# EAGLE design 644-alt-layout-routed (EAGLE 7.2.0)
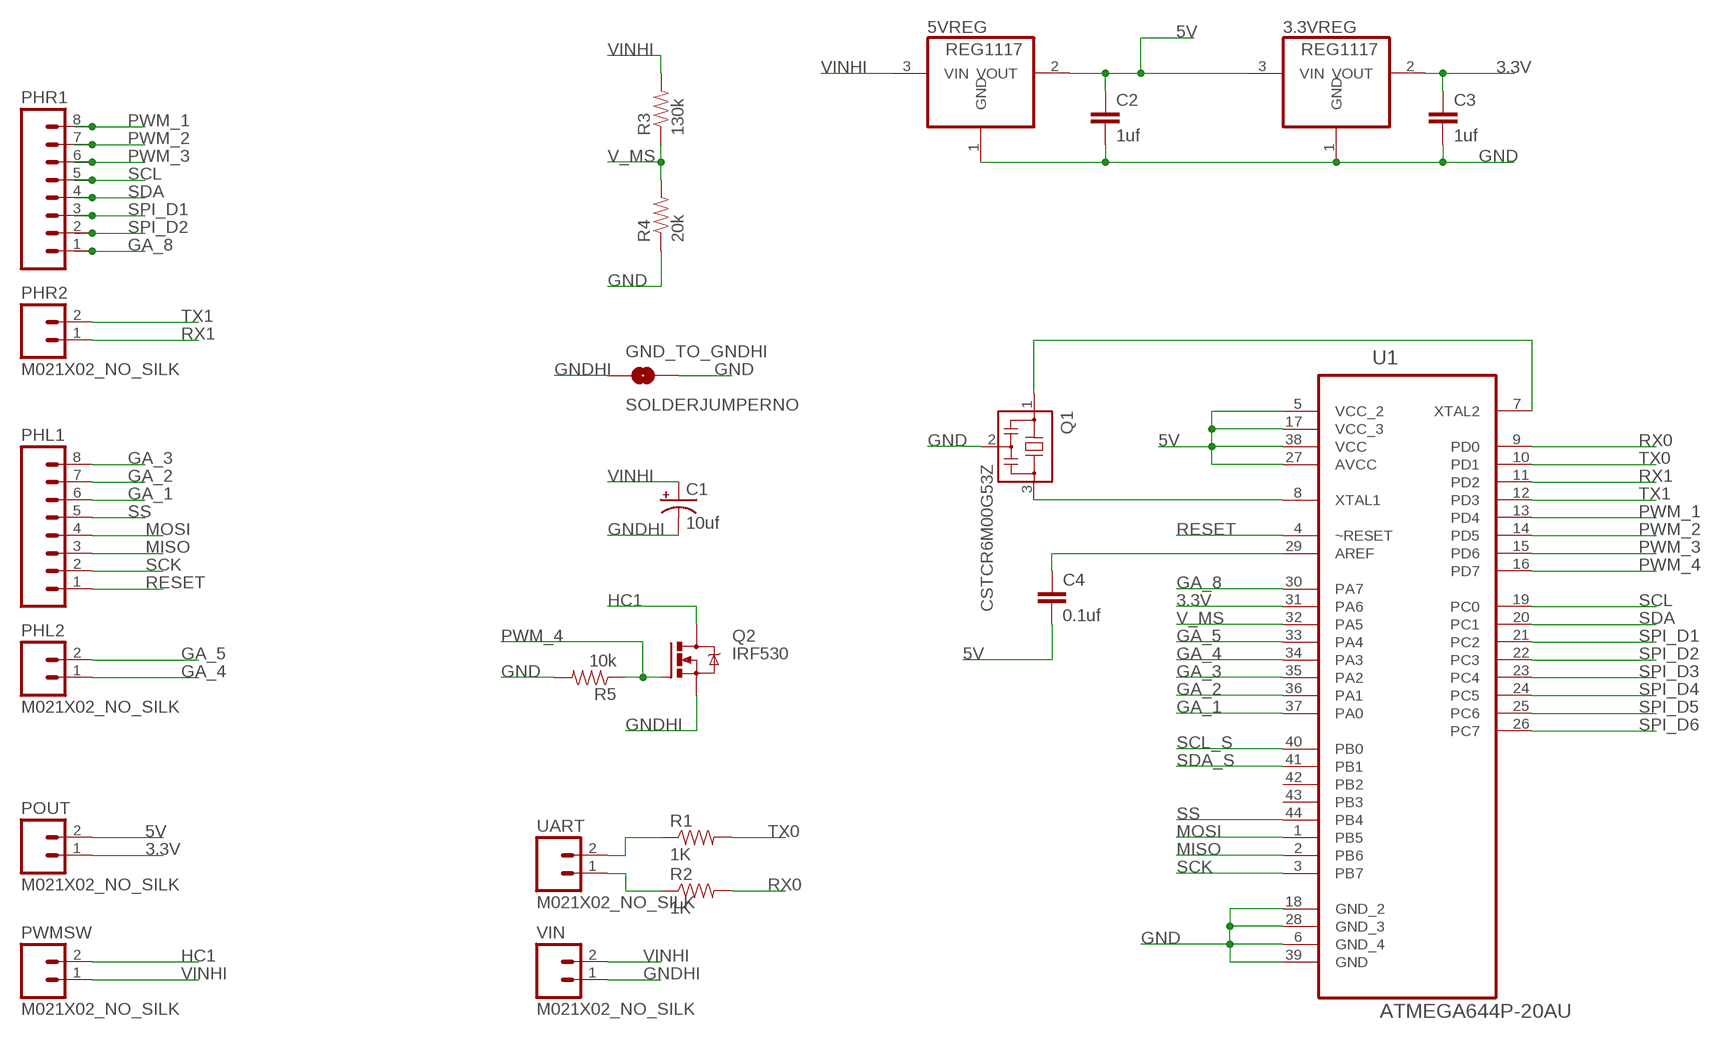
[diagram p0: schematic, sheet 1]

## Parts
3.3VREG  REG1117  [SOT223]
5VREG  REG1117  [SOT223]
C1  10uf  CAP_POL1206  [EIA3216]
C2  1uf  CAP0603-CAP  [0603-CAP]
C3  1uf  CAP0603-CAP  [0603-CAP]
C4  0.1uf  CAP0603-CAP  [0603-CAP]
GND_TO_GNDHI  SOLDERJUMPERNO  [SJ_2S-NO]
PHL1  M08NO_SILK  [1X08_PIN1_NO_SILK]
PHL2  M021X02_NO_SILK  [1X02_NO_SILK]
PHR1  M08NO_SILK  [1X08_PIN1_NO_SILK]
PHR2  M021X02_NO_SILK  [1X02_NO_SILK]
POUT  M021X02_NO_SILK  [1X02_NO_SILK]
PWMSW  M021X02_NO_SILK  [1X02_NO_SILK]
Q1  CSTCR6M00G53Z  [CSTCR6M]
Q2  IRF530  [TO220BV]
R1  1K  RESISTOR0603-RES  [0603-RES]
R2  1K  RESISTOR0603-RES  [0603-RES]
R3  130k  RESISTOR0603-RES  [0603-RES]
R4  20k  RESISTOR0603-RES  [0603-RES]
R5  10k  RESISTOR0603-RES  [0603-RES]
U1  ATMEGA644P-20AU  [QFP80P1200X1200X120-44N]
UART  M021X02_NO_SILK  [1X02_NO_SILK]
VIN  M021X02_NO_SILK  [1X02_NO_SILK]

## Nets
3.3V: 3.3VREG.2(VOUT) C3.1 POUT.1 U1.31(PA6)
5V: 3.3VREG.3(VIN) 5VREG.2(VOUT) C2.1 C4.2 POUT.2 U1.5(VCC_2) U1.17(VCC_3) U1.27(AVCC) U1.38(VCC)
GA_1: PHL1.6 U1.37(PA0)
GA_2: PHL1.7 U1.36(PA1)
GA_3: PHL1.8 U1.35(PA2)
GA_4: PHL2.1 U1.34(PA3)
GA_5: PHL2.2 U1.33(PA4)
GA_8: PHR1.1 U1.30(PA7)
GND: 3.3VREG.1(GND) 5VREG.1(GND) C2.2 C3.2 GND_TO_GNDHI.2 Q1.2 R4.1 R5.2 U1.6(GND_4) U1.18(GND_2) U1.28(GND_3) U1.39(GND)
GNDHI [hi]: C1.C(-) GND_TO_GNDHI.1 Q2.S VIN.1
HC1 [hi]: PWMSW.2 Q2.D
MISO: PHL1.3 U1.2(PB6)
MOSI: PHL1.4 U1.1(PB5)
N$1: Q1.3 U1.8(XTAL1)
N$2: Q1.1 U1.7(XTAL2)
N$3: C4.1 U1.29(AREF)
N$4: R1.1 UART.2
N$5: R2.1 UART.1
PWM_1: PHR1.8 U1.13(PD4)
PWM_2: PHR1.7 U1.14(PD5)
PWM_3: PHR1.6 U1.15(PD6)
PWM_4: Q2.G R5.1 U1.16(PD7)
RESET: PHL1.1 U1.4(~RESET)
RX0: R2.2 U1.9(PD0)
RX1: PHR2.1 U1.11(PD2)
SCK: PHL1.2 U1.3(PB7)
SCL: PHR1.5 U1.19(PC0)
SCL_S: U1.40(PB0)
SDA: PHR1.4 U1.20(PC1)
SDA_S: U1.41(PB1)
SPI_D1: PHR1.3 U1.21(PC2)
SPI_D2: PHR1.2 U1.22(PC3)
SPI_D3: U1.23(PC4)
SPI_D4: U1.24(PC5)
SPI_D5: U1.25(PC6)
SPI_D6: U1.26(PC7)
SS: PHL1.5 U1.44(PB4)
TX0: R1.2 U1.10(PD1)
TX1: PHR2.2 U1.12(PD3)
V_MS: R3.1 R4.2 U1.32(PA5)
VINHI [hi]: 5VREG.3(VIN) C1.A(+) PWMSW.1 R3.2 VIN.2
Unconnected: U1.42(PB2) U1.43(PB3)

## Library data of the parts
3.3VREG 5VREG = burr-brown:REG1117: 800mA and 1A Low Dropout (LDO) Positive Regulator 1.8V, 2.5V, 2.85V, 3.3V, 5V, and Adj; MPN: REG1117; OC_FARNELL: 1097566; OC_NEWARK: 14P6981
C1 = SparkFun-Capacitors:CAP_POL: Capacitor Polarized These are standard SMD and PTH capacitors. Normally 10uF, 47uF, and 100uF in electrolytic and tantalum varieties. Always verify the external diameter of the through hole cap, it varies with capacity, voltage, and manufacturer. The EIA devices should be standard.
C2-C4 = SparkFun-Capacitors:CAP: Capacitor Standard 0603 ceramic capacitor, and 0.1" leaded capacitor.
GND_TO_GNDHI = SparkFun-Retired:SOLDERJUMPER: Solder Jumper Standard SMD solder jumper. Used to automate production. Two varients : Normally Open and Normally Closed are the same, but have different paste layers. NC will have a large amount of paste and should jumper during reflow.
PHL1 PHR1 = SparkFun-Connectors:M08: Header 8 Standard 8-pin 0.1" header. Use with straight break away headers (SKU : PRT-00116), right angle break away headers (PRT-00553), swiss pins (PRT-00743), machine pins (PRT-00117), and female headers (PRT-00115).
PHL2 PHR2 POUT PWMSW UART VIN = SparkFun-Connectors:M02: Standard 2-pin 0.1" header. Use with - straight break away headers ( PRT-00116) - right angle break away headers (PRT-00553) - swiss pins (PRT-00743) - machine pins (PRT-00117) - female headers (PRT-00115) Molex polarized connector foot print use with: PRT-08233 with associated crimp pins and housings. 2.54_SCREWTERM for use with PRT-10571. 3.5mm Screw Terminal footprints for PRT-08084 5mm Screw Terminal footprints for use with PRT-08432
Q1 = murata-filter:CSTCR: Resonator Source: murata.co.jp; MPN: CSTCR6M00G53-R0; OC_FARNELL: 1170434; OC_NEWARK: 25M8759
Q2 = transistor-power:IRF530: HEXFET Power MOSFET
R1-R5 = SparkFun-Passives:RESISTOR: Resistor Basic schematic elements and footprints for 0603, 1206, and PTH resistors.
U1 = Atmel_By_element14_Batch_1-00:ATMEGA644P-20AU: 8-bit Microcontroller with Bytes In-System Programmable Flash; MPN: ATMEGA644P-20AU; OC_FARNELL: 1455121; OC_NEWARK: 58M3746; PACKAGE: TQFP-44; SUPPLIER: Atmel

## Net classes
0 default: width 0.203 mm, clearance 0.152 mm
1 hi: width 0.813 mm, clearance 0.152 mm

## Board
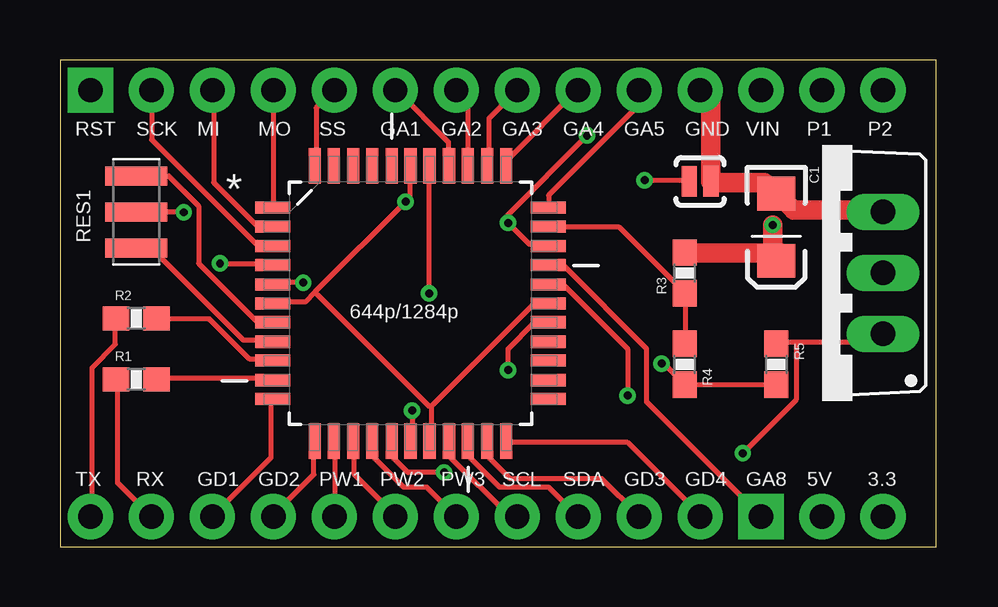
[diagram p1: board, top side]
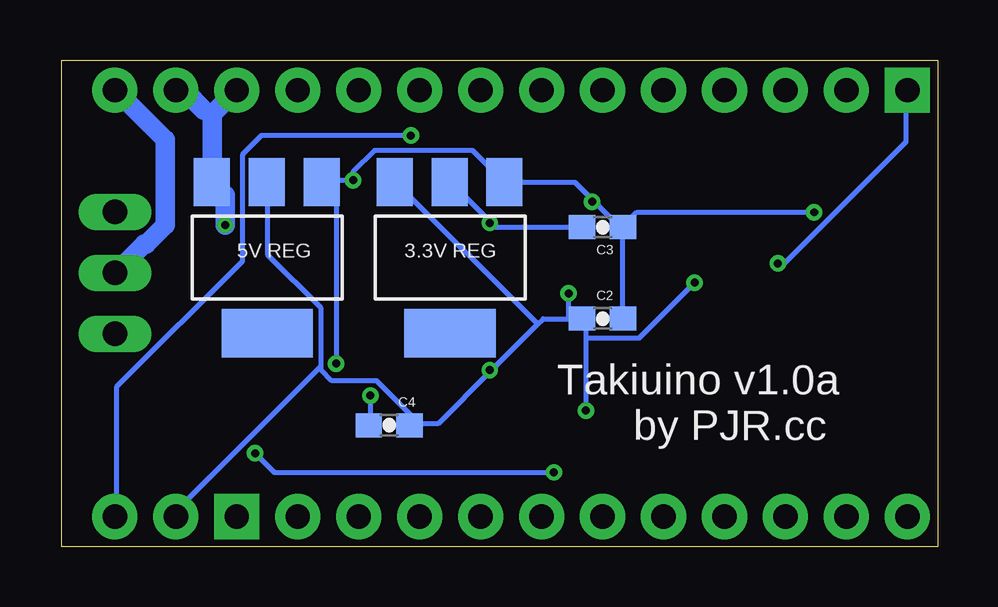
[diagram p2: board, bottom side, seen from below]

Size 36.5 x 20.31 mm. Coordinates in mm from the lower left corner, seen from the top.
Outline: 0,0 36.5,0 36.5,20.31 0,20.31 0,0
Copper layers (1*16): Top 0.0356mm / dielectric 1.5011mm / Bottom 0.0356mm
Design rules "LaenPCBOrder": minimum track width 6mil, minimum drill 13mil, track to track 6mil, track to pad 6mil, pad to pad 6mil, via to via 6mil, smd to smd 6mil, copper to edge 15mil, drill to drill 6mil, minimum pad ring 7mil, minimum via ring 7mil, stop-mask expansion 3mil, vias tented up to drill 0mil, thermal gap 10mil

### Footprints (pad centres in the part's own frame; a part is rotated, then mirrored left to right if it is on the bottom)
SOT223 = smd 1.499 x 2.007: 1 -2.261,-3.15; 2 0.025,-3.15; 3 2.311,-3.15 | smd 3.81 x 2.007: 4 0,3.15
EIA3216 = smd 1.4 x 1.6: A 1.4,0; C -1.4,0
0603-CAP = smd 1.1 x 1: 1 -0.85,0; 2 0.85,0
SJ_2S-NO = smd 0.635 x 1.27: 1 -0.45,0; 2 0.45,0
1X08_PIN1_NO_SILK = drill 1.016 pad 1.88 square: 1 0,0 | drill 1.016 pad 1.88: 2 2.54,0; 3 5.08,0; 4 7.62,0; 5 10.16,0; 6 12.7,0; 7 15.24,0; 8 17.78,0
1X02_NO_SILK = drill 1.016 pad 1.88: 1 0,0; 2 2.54,0
CSTCR6M = smd 0.8 x 2.6: 1 -1.5,0; 2 0,0; 3 1.5,0
TO220BV = drill 1.016 long: D 0,-2.54; G -2.54,-2.54; S 2.54,-2.54
0603-RES = smd 1.1 x 1: 1 -0.85,0; 2 0.85,0
QFP80P1200X1200X120-44N = smd 1.473 x 0.508: 1 -5.74,3.988; 2 -5.74,3.2; 3 -5.74,2.388; 4 -5.74,1.6; 5 -5.74,0.787; 6 -5.74,0; 7 -5.74,-0.787; 8 -5.74,-1.6; 9 -5.74,-2.388; 10 -5.74,-3.2; 11 -5.74,-3.988; 23 5.74,-3.988; 24 5.74,-3.2; 25 5.74,-2.388; 26 5.74,-1.6; 27 5.74,-0.787; 28 5.74,0; 29 5.74,0.787; 30 5.74,1.6; 31 5.74,2.388; 32 5.74,3.2; 33 5.74,3.988 | smd 0.508 x 1.473: 12 -3.988,-5.74; 13 -3.2,-5.74; 14 -2.388,-5.74; 15 -1.6,-5.74; 16 -0.787,-5.74; 17 0,-5.74; 18 0.787,-5.74; 19 1.6,-5.74; 20 2.388,-5.74; 21 3.2,-5.74; 22 3.988,-5.74; 34 3.988,5.74; 35 3.2,5.74; 36 2.388,5.74; 37 1.6,5.74; 38 0.787,5.74; 39 0,5.74; 40 -0.787,5.74; 41 -1.6,5.74; 42 -2.388,5.74; 43 -3.2,5.74; 44 -3.988,5.74

### Placement (x,y rotation side)
3.3VREG  20.32,12.06 180 bottom
5VREG  27.94,12.06 180 bottom
C1  29.84,13.34 270 top
C2  13.97,9.53 0 bottom
C3  13.97,13.34 0 bottom
C4  22.86,5.08 0 bottom
GND_TO_GNDHI  26.67,15.24 180 top
PHL1  1.27,19.05 0 top
PHL2  21.59,19.05 0 top
PHR1  29.21,1.27 180 top
PHR2  6.35,1.27 0 top
POUT  34.29,1.27 180 top
PWMSW  31.75,19.05 0 top
Q1  3.17,13.97 270 top
Q2  31.75,11.43 90 top
R1  3.17,6.99 0 top
R2  3.17,9.53 0 top
R3  26.04,11.43 90 top
R4  26.04,7.62 90 top
R5  29.84,7.62 270 top
U1  14.61,10.16 0 top
UART  1.27,1.27 0 top
VIN  26.67,19.05 0 top

### Tracks (layer width: path | path; a pad name or v marks a point on that pad's centre or on a via)
3.3V  (via drill 0.33)
  Top 0.203: U1.31 20.27,12.62 19.56,12.62 v18.67,13.51 18.67,13.87 v21.96,17.16
  Bottom 0.203: C3.1 18.4,13.34 18.62,13.56 | 18.62,13.56 20.27,15.2 3.3VREG.2 | v18.67,13.51 18.62,13.56 | v21.96,17.16 28.18,17.16 28.98,16.36 28.98,11.91 34.23,6.67 34.23,1.33 POUT.1
5V  (via drill 0.33)
  Top 0.203: v14.67,5.69 14.67,4.45 U1.17 | v10.13,11.02 8.89,11.02 U1.5 | v18.67,7.38 18.67,8.27 19.74,9.34 20.27,9.34 U1.27 | v15.38,10.58 15.38,15.82 U1.38
  Bottom 0.203: 15.38,9.51 16.45,9.51 16.67,9.29 | 15.38,9.51 14.85,9.51 C2.1 14.85,9.42 14.67,9.25 14.67,8.71 | 18.62,7.33 20.8,5.16 21.96,5.16 C4.2 21.96,5.25 21.96,5.51 23.38,6.93 25.25,6.93 25.69,7.38 25.69,7.47 | 18.62,7.33 16.67,9.29 | 14.67,8.71 v14.67,5.69 | v10.13,11.02 12.45,8.71 14.67,8.71 | v18.67,7.38 18.62,7.33 | 15.38,9.51 v15.38,10.58 | 16.67,9.29 22.58,15.2 3.3VREG.3 | 25.69,7.47 25.69,9.96 27.91,12.18 27.91,15.2 5VREG.2 | POUT.2 31.74,1.33 31.74,1.51 25.78,7.47 25.69,7.47
GA_1
  Top 0.203: U1.37 16.18,15.91 16.18,16.89 14.05,19.02 PHL1.6
GA_2
  Top 0.203: PHL1.7 16.98,18.58 16.98,15.91 U1.36
GA_3
  Top 0.203: PHL1.8 17.87,17.87 17.87,15.91 U1.35
GA_4
  Top 0.203: U1.34 18.67,15.91 18.67,16.18 21.51,19.02 PHL2.1
GA_5
  Top 0.203: U1.33 20.36,14.22 20.36,14.67 24.09,18.4 24.09,19.02 PHL2.2
GA_8
  Top 0.203: U1.30 20.36,11.73 20.98,11.73 24.45,8.27 24.45,6.04 29.16,1.33 PHR1.1
GND  (via drill 0.33)
  Top 0.203: 15.47,5.87 15.47,4.45 U1.18 | 15.47,5.87 19.74,10.13 20.27,10.13 U1.28 | 10.62,10.62 v14.4,14.4 14.58,14.58 14.58,15.82 U1.39 | 10.62,10.62 10.22,10.22 8.89,10.22 U1.6 | 10.62,10.62 15.38,5.87 15.47,5.87 | R5.2 29.78,6.76 26.05,6.76 R4.1 25.96,6.84 25.16,7.64 v25.07,7.64 | v24.36,15.29 26.14,15.29 GND_TO_GNDHI.2 | v5.16,13.96 3.2,13.96 Q1.2
  Bottom 0.203: C2.2 13.16,9.6 13.16,13.34 C3.2 | 14.36,14.45 13.25,13.34 C3.2 | 14.36,14.45 15.11,15.2 18.05,15.2 3.3VREG.1 19.38,16.54 23.47,16.54 24.36,15.65 v24.36,15.29 25.6,15.29 5VREG.1 25.07,15.2 v25.07,7.64 | v5.16,13.96 12.54,13.96 13.07,13.42 C3.2 | v14.4,14.4 14.36,14.45
GNDHI
  Top 0.813: VIN.1 26.67,19.02 27.11,18.58 27.11,15.65 GND_TO_GNDHI.1 27.2,15.2 29.34,15.2 29.78,14.76 C1.C 30.14,14.49 30.58,14.05 34.23,14.05 Q2.S
HC1
  Bottom 0.813: Q2.D 34.23,11.47 33.07,12.62 32.98,12.62 32.18,13.42 32.18,16.98 34.23,19.02 PWMSW.2
MISO
  Top 0.203: U1.2 8.8,13.42 8.18,13.42 6.4,15.2 6.4,19.02 PHL1.3
MOSI
  Top 0.203: PHL1.4 8.89,14.22 U1.1
N$1
  Top 0.203: U1.8 8.8,8.62 7.64,8.62 3.82,12.45 3.2,12.45 Q1.3
N$2
  Top 0.203: U1.7 8.8,9.42 8.18,9.42 5.78,11.82 5.78,14.22 4.53,15.47 3.2,15.47 Q1.1
N$3  (via drill 0.33)
  Top 0.203: v23.65,6.31 23.65,8.27 20.98,10.94 20.36,10.94 U1.29
  Bottom 0.203: v23.65,6.31 23.65,5.16 C4.1
N$4
  Top 0.203: R1.1 2.4,6.93 2.4,2.67 3.73,1.33 UART.2
N$5
  Top 0.203: R2.1 2.31,9.51 2.31,8.45 1.33,7.47 1.33,1.33 UART.1
PWM_1
  Top 0.203: U1.13 11.47,4.36 11.47,1.33 PHR1.8
PWM_2
  Top 0.203: U1.14 12.27,4.36 12.27,3.02 13.96,1.33 PHR1.7
PWM_3
  Top 0.203: PHR1.6 15.29,2.49 14.31,2.49 13.07,3.73 13.07,4.36 U1.15
PWM_4  (via drill 0.33)
  Top 0.203: 30.67,8.53 33.87,8.53 34.23,8.89 Q2.G | 30.67,8.53 29.87,8.53 R5.1 | v16,3.11 14.49,3.11 13.87,3.73 13.87,4.36 U1.16 | v28.45,3.91 30.67,6.13 30.67,8.53
  Bottom 0.203: v16,3.11 27.65,3.11 v28.45,3.91
RESET  (via drill 0.33)
  Top 0.203: v6.67,11.82 8.8,11.82 U1.4
  Bottom 0.203: v6.67,11.82 6.4,11.82 1.33,16.89 1.33,19.02 PHL1.1
RX0
  Top 0.203: R2.2 4.09,9.51 6.22,9.51 7.91,7.82 8.8,7.82 U1.9
RX1
  Top 0.203: U1.11 8.8,6.13 8.8,3.73 6.4,1.33 PHR2.1
SCK
  Top 0.203: U1.3 8.8,12.62 8.18,12.62 3.82,16.98 3.82,19.02 PHL1.2
SCL
  Top 0.203: U1.19 16.27,4.36 16.27,3.73 18.67,1.33 19.02,1.33 PHR1.5
SDA
  Top 0.203: U1.20 17.07,4.36 17.07,3.73 18.31,2.49 20.36,2.49 21.51,1.33 PHR1.4
SPI_D1
  Top 0.203: U1.21 17.87,4.36 17.87,3.73 18.76,2.85 22.58,2.85 24.09,1.33 PHR1.3
SPI_D2
  Top 0.203: U1.22 18.67,4.36 23.65,4.36 26.67,1.33 PHR1.2
SS
  Top 0.203: U1.44 10.67,15.91 10.67,18.31 11.38,19.02 PHL1.5
TX0
  Top 0.203: R1.2 4.09,7.02 8.8,7.02 U1.10
TX1
  Top 0.203: U1.12 10.58,4.36 10.58,3.02 8.89,1.33 PHR2.2
V_MS
  Top 0.203: R4.2 26.05,8.53 R3.1 25.96,10.67 23.29,13.34 20.36,13.34 U1.32
VINHI  (via drill 0.33)
  Top 0.813: R3.2 26.05,12.27 29.52,12.27 29.78,12 C1.A 29.69,12.62 v29.69,13.42
  Bottom 0.813: 30.23,18.05 30.23,15.29 5VREG.3 29.96,14.94 29.69,14.67 v29.69,13.42 | 30.23,18.05 29.25,19.02 VIN.2 | PWMSW.1 31.74,19.02 31.38,19.02 30.58,18.22 30.23,18.05

### Text on the board
tNames: RST | SCK | MI | MO | SS | GA1 | GA2 | GA3 | GA4 | GA5 | GND | VIN | P1 | P2 | RES1 | 644p/1284p | TX | RX | GD1 | GD2 | PW1 | PW2 | PW3 | SCL | SDA | GD3 | GD4 | GA8 | 5V | 3.3
bNames: 3.3V REG | 5V REG | Takiuino v1.0a | by PJR.cc